# Altium schematic sheet Core_nRF52840.SchDoc
size A; SheetNumber: 2; SheetTotal: 3
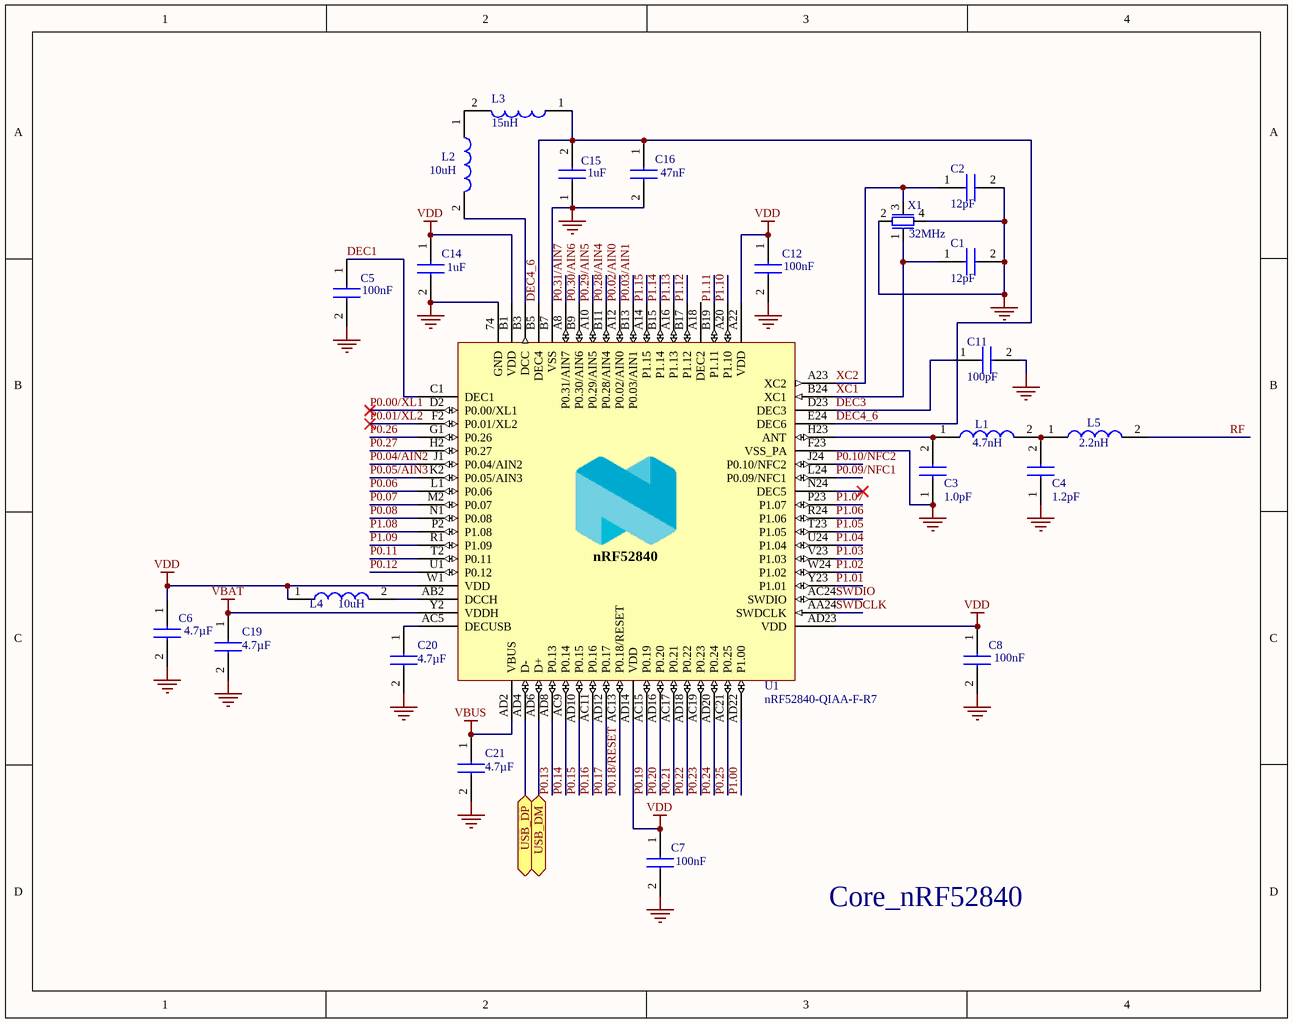
[diagram p0: Core_nRF52840.SchDoc]

## Parts
C1  12pF  [GCM155]
C2  12pF  [GCM155]
C3  1.0pF  [CAPC1005X55N]
C4  1.2pF  [CAPC1005X55N]
C5  100nF  [RESC1005X55N]
C6  4.7µF  [GRM18x]
C7  100nF  [RESC1005X55N]
C8  100nF  [RESC1005X55N]
C11  100pF  [CAPC1005X55N]
C12  100nF  [RESC1005X55N]
C14  1uF  [CAPC1608X95N]
C15  1uF  [CAPC1608X95N]
C16  47nF  [CAPC1005X55N]
C19  4.7µF  [GRM18x]
C20  4.7µF  [GRM18x]
C21  4.7µF  [GRM18x]
L1  4.7nH  [LQG15WH0N7B02D]
L2  10uH  [CAPC1608X95N]
L3  15nH  [LQG15WH0N7B02D]
L4  10uH  [CAPC1608X95N]
L5  2.2nH  [LQG15WH0N7B02D]
U1  nRF52840-QIAA-F-R7  [AQFN50P700X700X85_HS-74N]
X1  32MHz  [X201632MKB4SI]

## Ports
USB_DM (bidir, see Boat_Transmitter[1A], USB_Charge[3B]), USB_DP (bidir, see Boat_Transmitter[1A], USB_Charge[3B])

## Nets
GND: C1.2 C2.2 C3.1 C4.1 C5.2 C6.2 C7.2 C8.2 C11.2 C12.2 C14.2 C15.1 C16.2 C19.2 C20.2 C21.2 U1.74(GND) U1.B7(VSS) U1.F23(VSS_PA) X1.2(GND) X1.4(GND)
VBAT: C19.1 U1.Y2(VDDH)
VBUS: C21.1 U1.AD2(VBUS)
VDD: C6.1 C7.1 C8.1 C12.1 C14.1 L4.1 U1.A22(VDD) U1.AD14(VDD) U1.AD23(VDD) U1.B1(VDD) U1.W1(VDD)
DEC1: C5.1 U1.C1(DEC1)
DEC3: C11.1 U1.D23(DEC3)
DEC4_6: C15.2 C16.1 L3.1 U1.B5(DEC4) U1.E24(DEC6)
P0.00/XL1: U1.D2(P0.00/XL1)
P0.01/XL2: U1.F2(P0.01/XL2)
P0.02/AIN0: U1.A12(P0.02/AIN0)
P0.03/AIN1: U1.B13(P0.03/AIN1)
P0.04/AIN2: U1.J1(P0.04/AIN2)
P0.05/AIN3: U1.K2(P0.05/AIN3)
P0.06: U1.L1(P0.06)
P0.07: U1.M2(P0.07)
P0.08: U1.N1(P0.08)
P0.09/NFC1: U1.L24(P0.09/NFC1)
P0.10/NFC2: U1.J24(P0.10/NFC2)
P0.11: U1.T2(P0.11)
P0.12: U1.U1(P0.12)
P0.13: U1.AD8(P0.13)
P0.14: U1.AC9(P0.14)
P0.15: U1.AD10(P0.15)
P0.16: U1.AC11(P0.16)
P0.17: U1.AD12(P0.17)
P0.18/RESET: U1.AC13(P0.18/RESET)
P0.19: U1.AC15(P0.19)
P0.20: U1.AD16(P0.20)
P0.21: U1.AC17(P0.21)
P0.22: U1.AD18(P0.22)
P0.23: U1.AC19(P0.23)
P0.24: U1.AD20(P0.24)
P0.25: U1.AC21(P0.25)
P0.26: U1.G1(P0.26)
P0.27: U1.H2(P0.27)
P0.28/AIN4: U1.B11(P0.28/AIN4)
P0.29/AIN5: U1.A10(P0.29/AIN5)
P0.30/AIN6: U1.B9(P0.30/AIN6)
P0.31/AIN7: U1.A8(P0.31/AIN7)
P1.00: U1.AD22(P1.00)
P1.01: U1.Y23(P1.01)
P1.02: U1.W24(P1.02)
P1.03: U1.V23(P1.03)
P1.04: U1.U24(P1.04)
P1.05: U1.T23(P1.05)
P1.06: U1.R24(P1.06)
P1.07: U1.P23(P1.07)
P1.08: U1.P2(P1.08)
P1.09: U1.R1(P1.09)
P1.10: U1.A20(P1.10)
P1.11: U1.B19(P1.11)
P1.12: U1.B17(P1.12)
P1.13: U1.A16(P1.13)
P1.14: U1.B15(P1.14)
P1.15: U1.A14(P1.15)
RF: L5.2
SWDCLK: U1.AA24(SWDCLK)
SWDIO: U1.AC24(SWDIO)
USB_DM: U1.AD6(D+) ; port USB_DM
USB_DP: U1.AD4(D-) ; port USB_DP
XC1: C1.1 U1.B24(XC1) X1.1(inp)
XC2: C2.1 U1.A23(XC2) X1.3(out)
NetC3_2: C3.2 L1.1 U1.H23(ANT)
NetC4_2: C4.2 L1.2 L5.1
NetC20_1: C20.1 U1.AC5(DECUSB)
NetL2_1: L2.1 L3.2
NetL2_2: L2.2 U1.B3(DCC)
NetL4_2: L4.2 U1.AB2(DCCH)

Not connected (* = marked no-connect by the designer): U1 A18(DEC2) N24(DEC5)*

## Notes on the sheet
- Core_nRF52840
- (in symbol nRF52840-QIAA-F-R7) nRF52840

## Library data of the parts
C1 C2 = C_12pF_0402_C0G_1pct: 12 pF C0G ±1% 50 V; Manufacturer_Name: Murata Electronics; Manufacturer_Part_Number: GCM1555C1H120FA16D; Datasheet Link: https://search.murata.co.jp/Ceramy/image/img/A01X/G101/ENG/GCM1555C1H120FA16-01A.pdf; Height: 0.55mm; LCSC: C393682
C3 = C_1p0pF_0402_C0G_HQ: 1.0 pF C0G ±0.05 pF high-Q; Manufacturer_Name: Murata Electronics; Manufacturer_Part_Number: GJM1555C1H1R0WB01D; Datasheet Link: https://search.murata.co.jp/Ceramy/image/img/A01X/G101/ENG/GJM1555C1H1R0WB01-01A.pdf; Height: 0.55mm; LCSC: C72134
C4 = C_1p2pF_0402_C0G_HQ: 1.2 pF C0G ±0.05 pF high-Q; Manufacturer_Name: Murata Electronics; Manufacturer_Part_Number: GJM1555C1H1R2WB01D; Datasheet Link: https://search.murata.co.jp/Ceramy/image/img/A01X/G101/ENG/GJM1555C1H1R2WB01-01A.pdf; Height: 0.55mm; LCSC: C76899
C5 C7 C8 C12 = C_100nF_0402_X7R_50V: 100 nF X7R ±10% 50 V; Manufacturer_Name: SAMSUNG; Manufacturer_Part_Number: CL05B104KB54PNC; Datasheet Link: https://datasheet.lcsc.com/szlcsc/Samsung-Electro-Mechanics-CL05B104KB54PNC_C307331.pdf; Height: 0.55mm; LCSC: C307331
C6 C19-C21 = C_4u7F_0603_X7R_16V: 4.7 µF X7R ±10% 16 V; Manufacturer_Name: Murata Electronics; Manufacturer_Part_Number: GRM188Z71C475KE21D; Datasheet Link: https://search.murata.co.jp/Ceramy/image/img/A01X/G101/ENG/GRM188Z71C475KE21-01A.pdf; Height: 0.9mm; LCSC: C389010
C11 = C_100pF_0402_C0G: 100 pF C0G ±5% 50 V; Manufacturer_Name: Guangdong Fenghua Advanced Tech; Manufacturer_Part_Number: 0402CG101J500NT; Datasheet Link: https://datasheet.lcsc.com/szlcsc/Guangdong-Fenghua-Advanced-Tech-0402CG101J500NT_C1546.pdf; Height: 0.55mm; LCSC: C1546
C14 C15 = C_1uF_0603_X7R_50V: 1.0 µF X7R ±10% 50 V; Manufacturer_Name: SAMSUNG; Manufacturer_Part_Number: CL10B105KB8NQNC; Datasheet Link: https://product.samsungsem.com/mlcc/CL10B105KB8NQN.do; Height: 0.95mm; LCSC: C5199872
C16 = C_47nF_0402_X7R_50V: 47 nF X7R ±10% 50 V; Manufacturer_Name: Yageo Group; Manufacturer_Part_Number: CC0402KRX7R9BB473; Datasheet Link: https://4donline.ihs.com/images/VipMasterIC/IC/YAGO/YAGO-S-A0011723860/YAGO-S-A0011723860-1.pdf?hkey=EF798316E3902B6ED9A73243A3159BB0; Height: 0.55mm; LCSC: C272875
L1 = L_4n7H_0402_RF: 4.7 nH ±0.1 nH RF; Manufacturer_Name: Murata Electronics; Manufacturer_Part_Number: LQG15HN4N7B02D; Datasheet Link: https://search.murata.co.jp/Ceramy/image/img/P02/JELF243B-0009.pdf; Height: 0.6mm; LCSC: C3911180
L2 L4 = L_10uH_0603: 10 µH ±20%, 400 mA, 0.55 Ω; Manufacturer_Name: Microgate; Manufacturer_Part_Number: MGFL1608F100MT-LF; LCSC: C281107; Height: 0.8mm
L3 = L_15nH_0402: 15 nH ±5%, 450 mA; Manufacturer_Name: Murata Electronics; Manufacturer_Part_Number: LQG15HS2N2B02D; Datasheet Link: https://search.murata.co.jp/Ceramy/image/img/P02/JELF243B-0010.pdf; Height: 0.6mm; LCSC: C86059
L5 = L_2n2H_0402_RF: 2.2 nH ±0.1 nH RF; Manufacturer_Name: Murata Electronics; Manufacturer_Part_Number: LQG15HS15NJ02D; Datasheet Link: https://search.murata.co.jp/Ceramy/image/img/P02/JELF243B-0010.pdf; Height: 0.6mm; LCSC: C162540
U1 = nRF52840-QIAA-F-R7: Multi-protocol Bluetooth Low Energy, IEEE 802.15.4, ANT and 2.4GHz proprietary system-on-chip; Manufacturer: Nordic Semiconductor; Manufacturer Part Number: nRF52840-QIAA-F-R7; DigiKey Part Number: 4823-NRF52840-QIAA-F-R7CT-ND; LCSC: C3606858
X1 = Y_32MHz_2016_8pF: 32 MHz, 8 pF, ±10/±20 ppm; Manufacturer_Name: Yangxing Tech; Datasheet Link: https://datasheet.lcsc.com/lcsc/2103291240_Yangxing-Tech-X201632MKB4SI_C718072.pdf; Height: 0.5mm; Manufacturer_Part_Number: X201632MKB4SI; LCSC: C718072